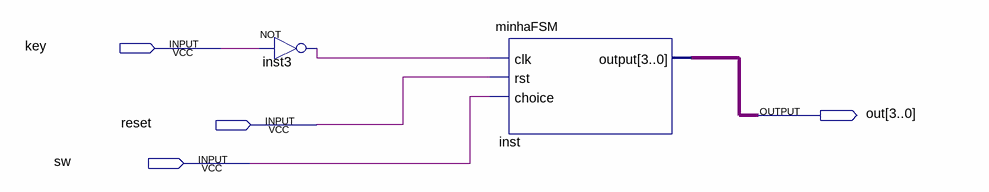
[diagram p0: schematic sheet]
// Quartus schematic maquina_de_estado_finita.bdf as structural Verilog: 2 symbols, 4 pins
module maquina_de_estado_finita (
  input  key,
  input  reset,
  input  sw,
  output [3:0] out
);

  wire inst3_out;

  not inst3 (inst3_out, key);
  minhaFSM inst (.clk(inst3_out), .rst(reset), .choice(sw), .\output (out));
endmodule
